# EAGLE design TrinketM0TopShield (EAGLE 9.1.0)
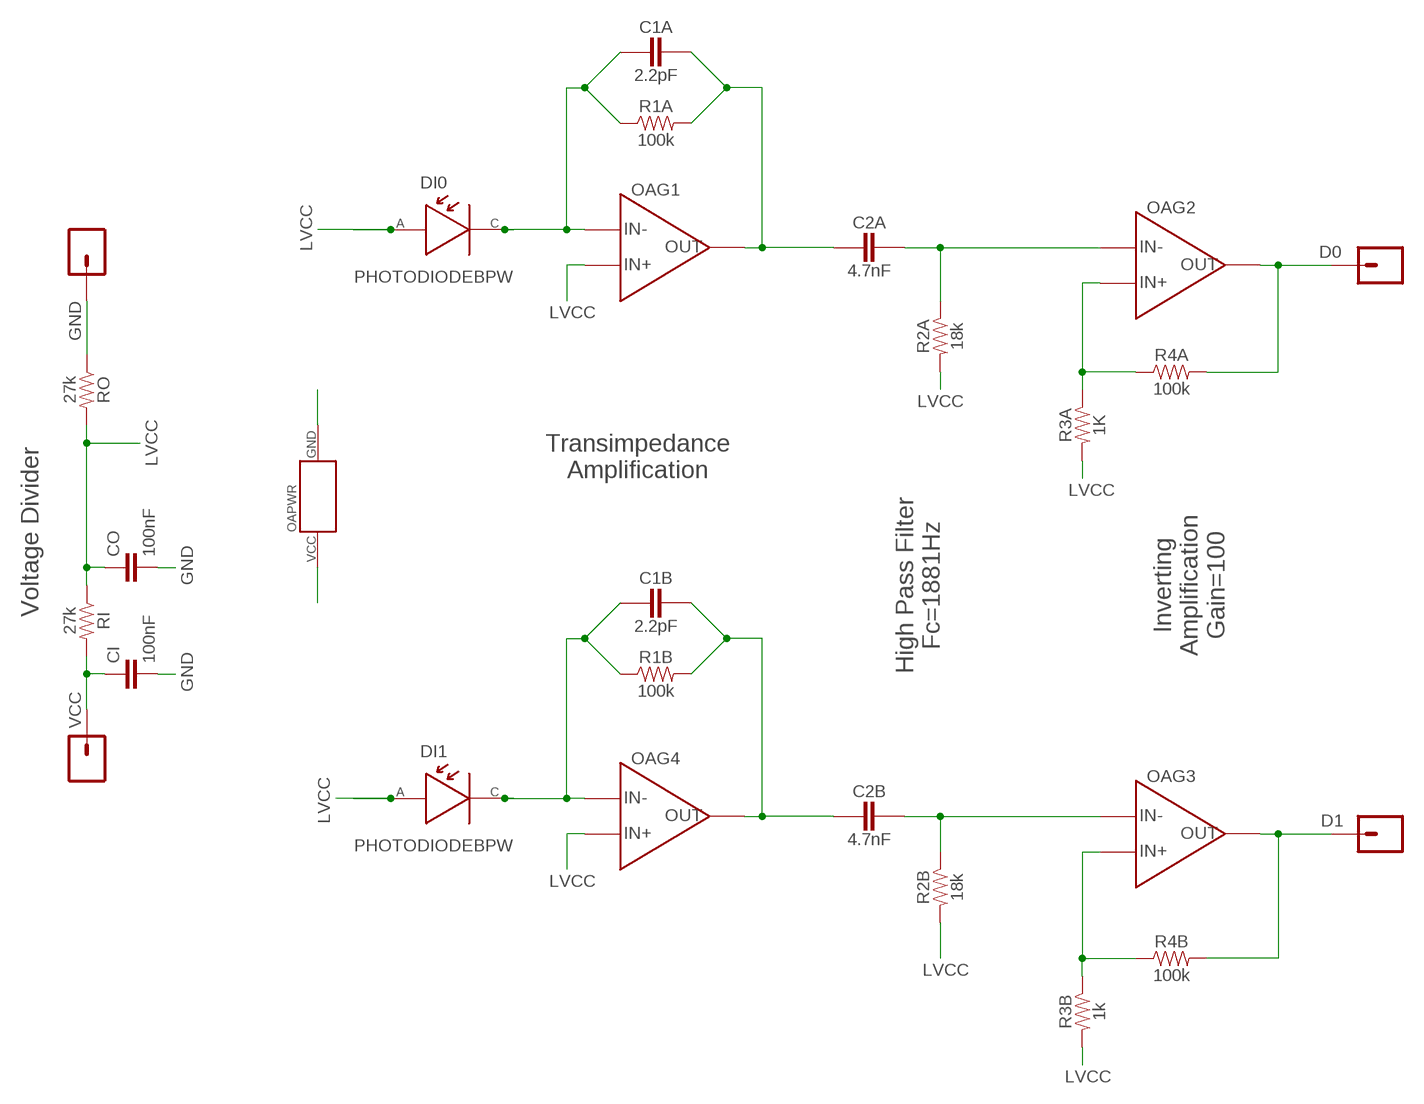
[diagram p0: schematic, sheet 1]

## Parts
C1A  2.2pF  CAPACITOR  [PASSIVE-0603]
C1B  2.2pF  CAPACITOR  [PASSIVE-0603]
C2A  4.7nF  CAPACITOR  [PASSIVE-0603]
C2B  4.7nF  CAPACITOR  [PASSIVE-0603]
CI  100nF  4.7PF-0603-50V-5%  [0603]
CO  100nF  4.7PF-0603-50V-5%  [0603]
D0  CONN_01PTH_NO_SILK_YES_STOP  [1X01_NO_SILK]
D1  CONN_01PTH_NO_SILK_YES_STOP  [1X01_NO_SILK]
D2  CONN_01PTH_NO_SILK_YES_STOP  [1X01_NO_SILK]
DI0  PHOTODIODEBPW  [BPW34_BP104_SMD]
DI1  PHOTODIODEBPW  [BPW34_BP104_SMD]
OA  TLV2464IPW  [PW14]
R1A  100k  RESISTOR  [PASSIVE-0603]
R1B  100k  RESISTOR  [PASSIVE-0603]
R2A  18k  RESISTOR  [PASSIVE-0603]
R2B  18k  RESISTOR  [PASSIVE-0603]
R3A  1K  RESISTOR  [PASSIVE-0603]
R3B  1k  RESISTOR  [PASSIVE-0603]
R4A  100k  RESISTOR  [PASSIVE-0603]
R4B  100k  RESISTOR  [PASSIVE-0603]
RI  27k  100KOHM-0603-1/10W-1%  [0603]
RO  27k  100KOHM-0603-1/10W-1%  [0603]
VCC  CONN_01PTH_NO_SILK_YES_STOP  [1X01_NO_SILK]

## Nets
D0: D0.1 OA.7(OUT) R4A.2
D1: D1.1 OA.8(OUT) R4B.2
D1IN: C1B.1 DI1.CATHODE OA.13(IN-) R1B.1
D1OA2P: C2B.2 OA.9(IN-) R2B.1
D1OAOUT1: C1B.2 C2B.1 OA.14(OUT) R1B.2
D2IN: C1A.1 DI0.CATHODE OA.2(IN-) R1A.1
D2OA1OUT: C1A.2 C2A.1 OA.1(OUT) R1A.2
D2OA2N: OA.5(IN+) R3A.1 R4A.1
D2OA2P: C2A.2 OA.6(IN-) R2A.1
GND: CI.2 CO.2 D2.1 OA.11(PWR:GND) RO.1
LVCC: CO.1 DI0.ANODE DI1.ANODE OA.3(IN+) OA.12(IN+) R2A.2 R2B.2 R3A.2 R3B.2 RI.1 RO.2
N$11: OA.10(IN+) R3B.1 R4B.1
VCC: CI.1 OA.4(PWR:VCC) RI.2 VCC.1

## Notes on the sheet
- Transimpedance
  Amplification
- Voltage Divider
- High Pass Filter
  Fc=1881Hz
- Inverting
  Amplification
  Gain=100

## Library data of the parts
C1A C1B C2A C2B = ZippyComponentLibrary:CAPACITOR
CI CO = SparkFun-Capacitors:4.7PF: 4.7pF ceramic capacitors A capacitor is a passive two-terminal electrical component used to store electrical energy temporarily in an electric field.; PROD_ID: CAP-07880; VALUE: 4.7pF
D0 D1 D2 VCC = SparkFun-Connectors:CONN_01: Single connection point. Often used as Generic Header-pin footprint for 0.1 inch spaced/style header connections On any of the 0.1 inch spaced packages, you can populate with these: Break Away Headers - Straight <https://www.sparkfun.com/products/116> (PRT-00116) Break Away Male Headers - Right Angle <https://www.sparkfun.com/products/553> (PRT-00553) Female Headers <https://www.sparkfun.com/products/115> (PRT-00115) Break Away Headers - Machine Pin <https://www.sparkfun.com/products/117> (PRT-00117) Break Away Female Headers - Swiss Machine Pin <https://www.sparkfun.com/products/743> (PRT-00743) This device is also useful as a general connection point to wire up your design to another part of your project. Our various solder wires solder well into these plated through hole pads. Hook-Up Wire - Assortment (Stranded, 22 AWG) <https://www.sparkfun.com/products/11375> (PRT-11375) Hook-Up Wire - Assortment (Solid Core, 22 AWG) <https://www.sparkfun.com/products/11367> (PRT-11367) View the entire wire category on our website here <https://www.sparkfun.com/categories/141> Special notes: SMTSO-256-ET is a "flush mount" nut for a 4-40 screw. We mostly use this on specialty testbeds; it is a nice way to connect hardware to your PCB at an adjustable hieght. Also note, the SNAP packages are for using a snappable style connector. We sell a baggie of snaps and they are also used on two LilyPad designs: Snap Assortment - 30 pack (male and female) <https://www.sparkfun.com/products/11347> (DEV-11347) LilyPad Arduino SimpleSnap <https://www.sparkfun.com/products/10941> (DEV-10941) LilyPad SimpleSnap Protoboard <https://www.sparkfun.com/products/10940> (DEV-10940)
DI0 DI1 = ZippyComponentLibrary:PHOTODIODE: "2x1 SMD Mounting Point For BPW34 Diode"
OA = ZippyComponentLibrary:TLV2464
R1A R1B R2A R2B R3A R3B R4A R4B = ZippyComponentLibrary:RESISTOR
RI RO = SparkFun-Resistors:100KOHM: 100kΩ resistor A resistor is a passive two-terminal electrical component that implements electrical resistance as a circuit element. Resistors act to reduce current flow, and, at the same time, act to lower voltage levels within circuits. - Wikipedia; PROD_ID: RES-07828; VALUE: 100k

## Board
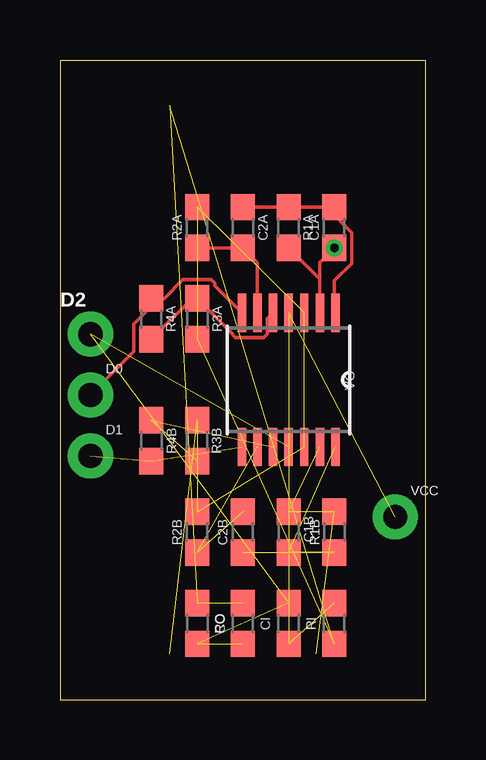
[diagram p1: board, top side]
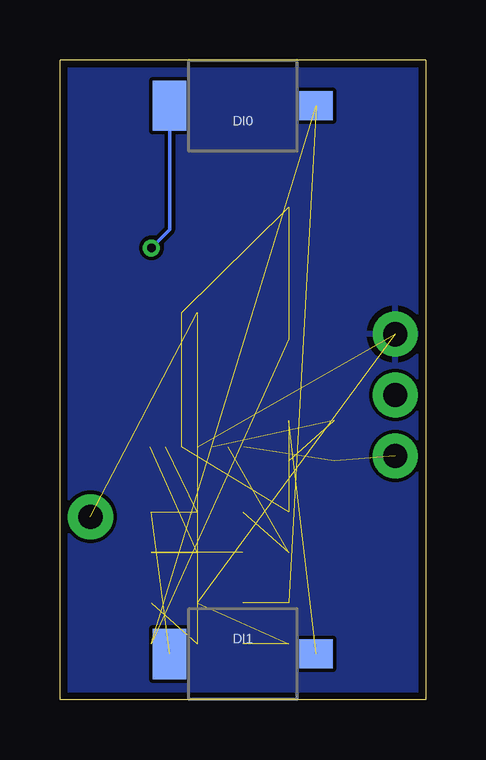
[diagram p2: board, bottom side, seen from below]

Size 15.24 x 26.67 mm. Coordinates in mm from the lower left corner, seen from the top.
Outline: 0,0 15.24,0 15.24,26.67 0,26.67 0,0
Copper layers (1*16): Top 0.0356mm / dielectric 1.5011mm / Bottom 0.0356mm
Design rules "LaenPCBOrder *": minimum track width 6mil, minimum drill 13mil, track to track 6mil, track to pad 6mil, pad to pad 6mil, via to via 6mil, smd to smd 6mil, copper to edge 12mil, drill to drill 6mil, minimum pad ring 7mil, minimum via ring 7mil, stop-mask expansion 3mil, vias tented up to drill 0mil, thermal gap 10mil

### Footprints (pad centres in the part's own frame; a part is rotated, then mirrored left to right if it is on the bottom)
PASSIVE-0603 = smd 1.1 x 1: 1 -0.85,0; 2 0.85,0
0603 = smd 1.1 x 1: 1 -0.85,0; 2 0.85,0
1X01_NO_SILK = drill 1.016 pad 1.88: 1 0,0
BPW34_BP104_SMD = smd 1.4 x 1.2: ANODE -3.05,0 | smd 1.4 x 2.1: CATHODE 3.05,0
PW14 = smd 1.6 x 0.35: 1 -2.8,1.95; 2 -2.8,1.3; 3 -2.8,0.65; 4 -2.8,0; 5 -2.8,-0.65; 6 -2.8,-1.3; 7 -2.8,-1.95; 8 2.8,-1.95; 9 2.8,-1.3; 10 2.8,-0.65; 11 2.8,0; 12 2.8,0.65; 13 2.8,1.3; 14 2.8,1.95

### Placement (x,y rotation side)
C1A  11.43,19.68 90 top
C1B  9.53,6.99 270 top
C2A  7.62,19.68 270 top
C2B  7.62,6.99 90 top
CI  9.53,3.17 90 top
CO  5.71,3.17 270 top
D0  1.27,12.7 0 top
D1  1.27,10.16 0 top
D2  1.27,15.24 0 top
DI0  7.62,24.77 180 bottom
DI1  7.62,1.91 180 bottom
OA  9.53,13.34 270 top
R1A  9.53,19.68 90 top
R1B  11.43,6.99 270 top
R2A  5.71,19.68 90 top
R2B  5.71,6.99 90 top
R3A  5.71,15.88 270 top
R3B  5.71,10.79 90 top
R4A  3.81,15.88 90 top
R4B  3.81,10.79 270 top
RI  11.43,3.17 90 top
RO  7.62,3.17 90 top
VCC  13.97,7.62 0 top

### Tracks (layer width: path | path; a pad name or v marks a point on that pad's centre or on a via)
D0
  Top 0.152: OA.7 6.44,17.27 6.44,17.37 6.31,17.5 5.12,17.5 4.34,16.73 R4A.2 3.81,16.4 3.08,15.67 3.08,14.51 D0.1
D1  (2 unrouted)
D1IN  (3 unrouted)
D1OA2P  (2 unrouted)
D1OAOUT1  (3 unrouted)
D2IN  (via drill 0.35)
  Top 0.152: v11.43,18.84 10.82,18.23 OA.2 10.82,17.54 R1A.1
  Bottom 0.152: DI0.CATHODE 10.67,19.59 v11.43,18.84
D2OA1OUT
  Top 0.152: C2A.1 R1A.2 C1A.2 11.43,20.21 12.16,19.48 12.16,18.19 11.43,17.46 11.43,16.18 OA.1
D2OA2N
  Top 0.152: R4A.1 5.51,16.73 R3A.1 7.17,15.27 7.17,15.24 7.3,15.11 8.49,15.11 8.63,15.24 8.63,15.89 OA.5
D2OA2P
  Top 0.152: OA.6 8.22,18.23 C2A.2 R2A.1
GND  (4 unrouted)
  pour Bottom: 15.24,26.67 0,26.67 0,0 15.24,0
LVCC  (10 unrouted)
N$11  (2 unrouted)
VCC  (3 unrouted)